# Altium schematic sheet RS485.SchDoc
size A; SheetNumber: 15; SheetTotal: 15
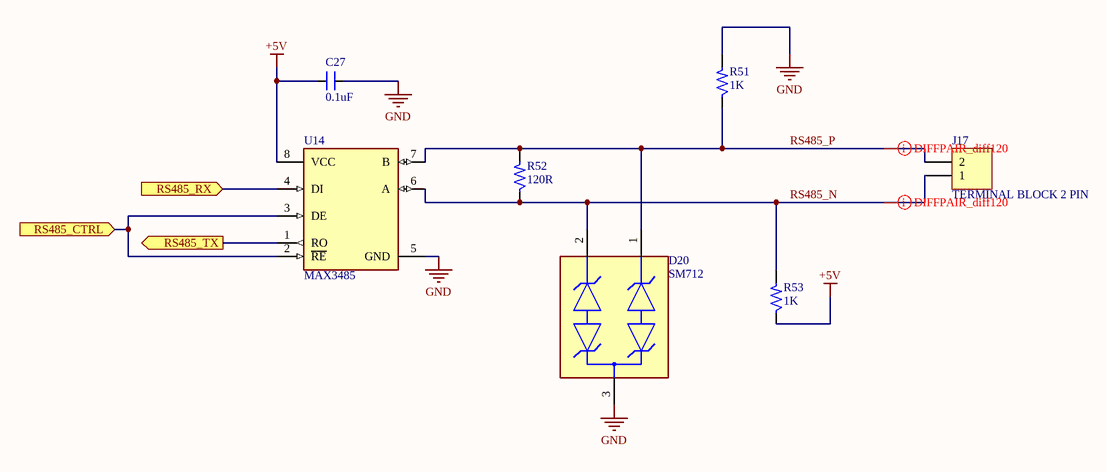
[diagram p0: RS485.SchDoc]

## Parts
C27  0.1uF  [CAP_0805]
D20  SM712  [FP-SM712-MFG]
J17  TERMINAL BLOCK 2 PIN  [CON2_P196_1729128_TH_ST]
R51  1K  [RES_0805]
R52  120R  [RES_0805]
R53  1K  [RES_0805]
U14  MAX3485  [FP-S8-5-IPC_C]

## Ports
RS485_CTRL (in, see Block Diagram[3C], ATMEGA2560-16AU[2C]), RS485_RX (in, see Block Diagram[3C]), RS485_TX (out, see Block Diagram[3C])

## Nets
+5V: C27.2 R53.1 U14.8(VCC)
GND: C27.1 D20.3 R51.2 U14.5(GND)
RS485_CTRL: U14.2(~{RE}) U14.3(DE) ; port RS485_CTRL
RS485_N: D20.2 J17.1 R52.1 R53.2 U14.6(A)
RS485_P: D20.1 J17.2 R51.1 R52.2 U14.7(B)
RS485_RX: U14.4(DI) ; port RS485_RX
RS485_TX: U14.1(RO) ; port RS485_TX

## Layout directives
differential pair; differential pair class DIFFPAIR_diff120: RS485_N, RS485_P

## Library data of the parts
C27 = CAP_0.1uF-50V-5%-0805: 0.1µF ±5% 50V Ceramic Capacitor X7R 0805 (2012 Metric); Manufacturer: AVX Corporation; Manufacturer Part Number: 08055C104JAT4A; Alternate Part Number-1: 0805B104M500; Case/Package: 0805; Supplier-1: SIRICOM; Supplier Part Number-1: 0805B104J500CT; ClassName: RS485
D20 = SM712-02HTG: TVS DIODE 12V 31V SOT23-3; Leakage Current: 20uA; Polarity: Bidirectional; Breakdown Voltage: 13.3V; Max Power Dissipation: 600W; Number of Channels: 2; Max Surge Current: 19A; Capacitance: 75pF; Power Line Protection: No; Element Configuration: Dual; Number of Pins: 3; Radiation Hardening: No; Clamping Voltage: 31V; Mount: Surface Mount; Reverse Standoff Voltage: 12V; Peak Pulse Power: 600W; Lead Free: Lead Free; Direction: Bidirectional; Packaging: Tape and Reel; Case/Package: SOT-23-3; Number of Bidirectional Channels: 2; Termination: SMD/SMT; Max Operating Temperature: 125°C; Min Breakdown Voltage: 13.3V; Depth: 1.4mm; Package Quantity: 3000; Working Voltage: 12V; Length: 3.04mm; Peak Pulse Current: 19A; Composition: Zener; Min Operating Temperature: -40°C; ClassName: RS485
J17 = CON-TB_2X1-196-ST-TH: 2 Pins, 1 Row 5mm Pitch, straight Connector, male; Manufacturer: Phoenix Contact; Manufacturer Part Number: MKDSN1,5/2; Alternate Part Number-1: NA; Case/Package: TH-CON; Supplier-1: SP ROAD; Supplier Part Number-1: MKDSN1,5/2; ClassName: RS485
R51 R53 = RES_1K-0.125W-1%-0805: 1 kOhms ±1% 0.125W, 1/8W Chip Resistor 0805 (2012 Metric) Moisture Resistant Thick Film; Manufacturer: Walsin; Manufacturer Part Number: WR08X1001FTL; Case/Package: 0805; Supplier-1: SP ROAD; Supplier Part Number-1: RC0805JR-071KL; Alternate Part Number-1: WR08X1001FTL; ClassName: RS485
R52 = RES_120R-0.125W-1%-0805: 120 Ohms ±1% 0.125W, 1/8W Chip Resistor 0805 (2012 Metric) Automotive AEC-Q200, Moisture Resistant Thick Film; Manufacturer: Stackpole Electronics; Manufacturer Part Number: CRGCQ0805F120R; Alternate Part Number-1: NA; Case/Package: 0805; Supplier-1: SIRICOM; Supplier Part Number-1: WR08X1200FTL; ClassName: RS485
U14 = MAX3485ESA+: IC TXRX RS485/422 10MBPS 8SOIC; Manufacturer: Maxim Integrated; Nominal Supply Current: 0.95-1.1mA; Data Rate: 10Mbits/s; Min Supply Voltage: 3V; Interface: RS-485,RS-422; Number Of Transmitters: 1; Max Supply Voltage: 3.6V; Max Junction Temp: +160°C; Standoff Height: 0.1mm; Simplex Duplex: Half Duplex; Height: 1.75mm; Temperature Range High: +85°C; Device Class L2: Interface ICs; Digikey Description: IC TXRX RS485/422 10MBPS 8SOIC; Temperature: -40°C to +85°C; Device Class L3: RS-232 / RS-422 / RS-485 Interface ICs; Temperature Range Low: -40°C; Footprint Url: https://pdfserv.maximintegrated.com/land_patterns/90-0096.PDF; Category: IC; ComponentLink2URL: https://datasheets.maximintegrated.com/en/ds/MAX3483-MAX3491.pdf; Package: S8-5; Octopart: https://octopart.com/max3485esa%2B-maxim+integrated-39731860; RoHS: TRUE; Manufacturer Part Number: MAX3485ESA+; Lead Free: Yes; ComponentLink2Description: Datasheet; Device Class L1: Integrated Circuits (ICs); Mouser Description: 3.3V Powered, 10Mbps and Slew-Rate Limited, True RS-485/RS-422 Transceivers; Number Of Receivers: 1; Automotive: No; ClassName: RS485